# EAGLE design Si7034 (EAGLE 7.4.0)
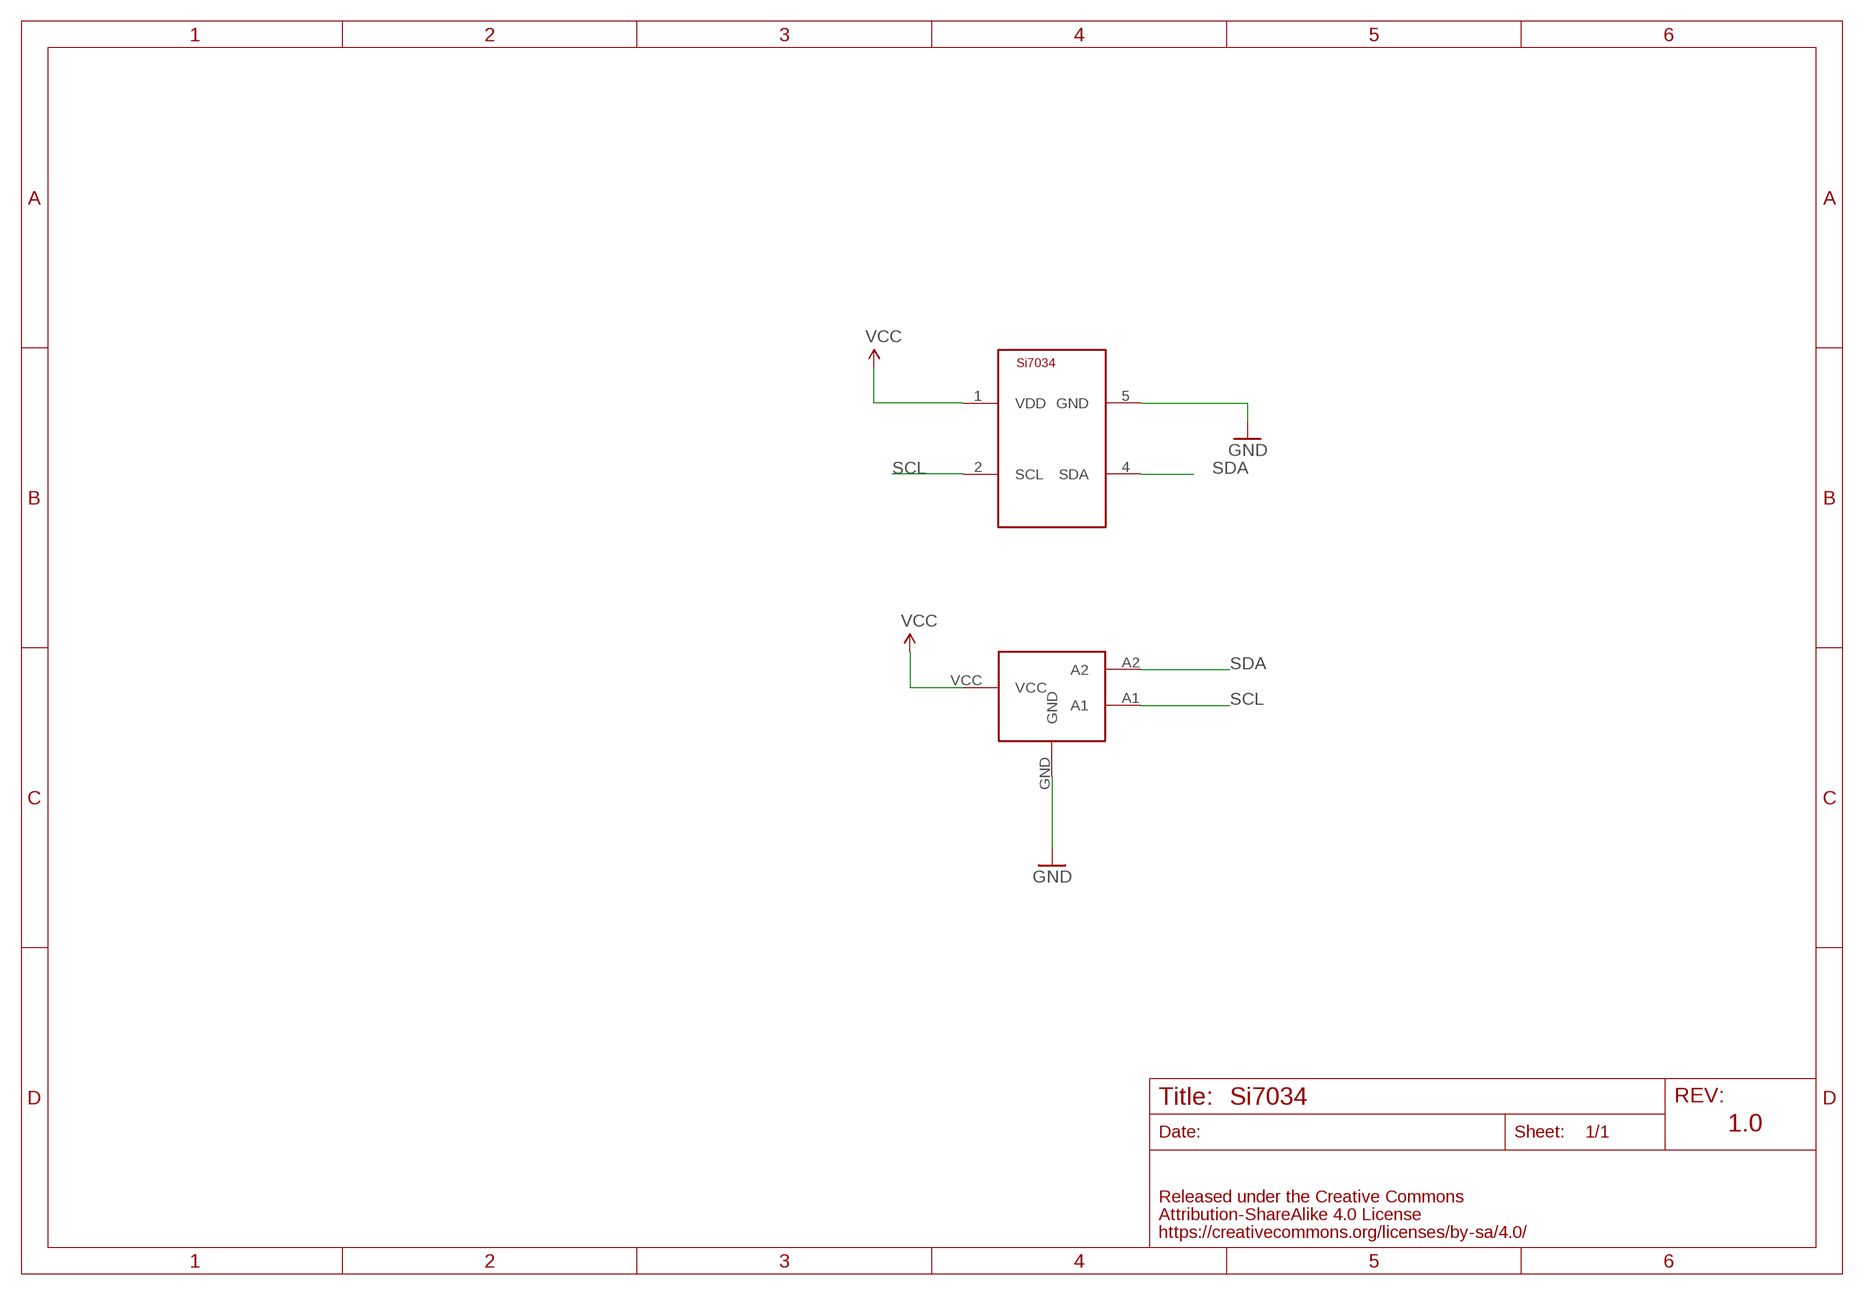
[diagram p0: schematic, sheet 1]

## Parts
U$3  SILICONLABS-SI7034  [SILICONLABS-SI7034]
U$5  4PIN  [4PIN]

## Nets
GND: U$3.5(GND) U$5.GND
SCL: U$3.2(SCL) U$5.A1
SDA: U$3.4(SDA) U$5.A2
VCC: U$3.1(VDD) U$5.VCC

## Notes on the sheet
- 1.0

## Library data of the parts
U$3 = FaBo-Mems:SILICONLABS-SI7034
U$5 = FaBo-Breakout:4PIN

## Board
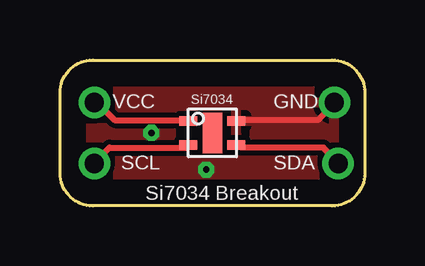
[diagram p1: board, top side]
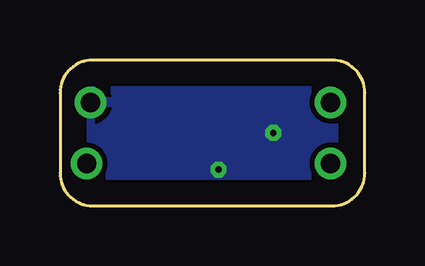
[diagram p2: board, bottom side, seen from below]

Size 12.7 x 6.08 mm. Coordinates in mm from the lower left corner, seen from the top.
Copper layers (1*16): Top 0.035mm / dielectric 1.5mm / Bottom 0.035mm
Design rules "default": minimum track width 10mil, minimum drill 24mil, track to track 8mil, track to pad 8mil, pad to pad 8mil, via to via 8mil, smd to smd 8mil, copper to edge 40mil, drill to drill 8mil, minimum pad ring 10mil, minimum via ring 8mil, stop-mask expansion 4mil, vias tented up to drill 0mil, thermal gap 10mil

### Footprints (pad centres in the part's own frame; a part is rotated, then mirrored left to right if it is on the bottom)
SILICONLABS-SI7034 = smd 0.75 x 0.4: 1 -1,0.5; 2 -1,-0.5; 4 1,-0.5; 5 1,0.5 | smd 0.8 x 1.7: 36 0,0
4PIN = drill 0.8: A1 -4.92,-1.27; A2 5.24,-1.27; GND 5.08,1.27; VCC -4.92,1.27

### Placement (x,y rotation side)
U$3  6.35,3.04 0 top
U$5  6.35,3.04 0 top

### Tracks (layer width: path | path; a pad name or v marks a point on that pad's centre or on a via)
GND  (via drill 0.26)
  Top 0.254: U$3.5 7.54,3.57 10.74,3.57 11.43,4.26 U$5.GND
  other vias: 3.81,3.04 6.1,1.52
  pour Top: 0,-0.77 12.7,-0.77 12.7,6.6 0,6.6
  pour Bottom: 0,-0.77 12.7,-0.77 12.7,6.6 0,6.6
SCL
  Top 0.254: U$3.2 5.26,2.43 2.06,2.43 1.6,1.97 U$5.A1
SDA
  Top 0.254: U$3.4 7.54,2.43 10.97,2.43 11.43,1.97 U$5.A2
VCC
  Top 0.254: U$3.1 5.26,3.57 2.29,3.57 1.6,4.26 U$5.VCC

### Text on the board
tPlace: SCL | SDA | Si7034 Breakout